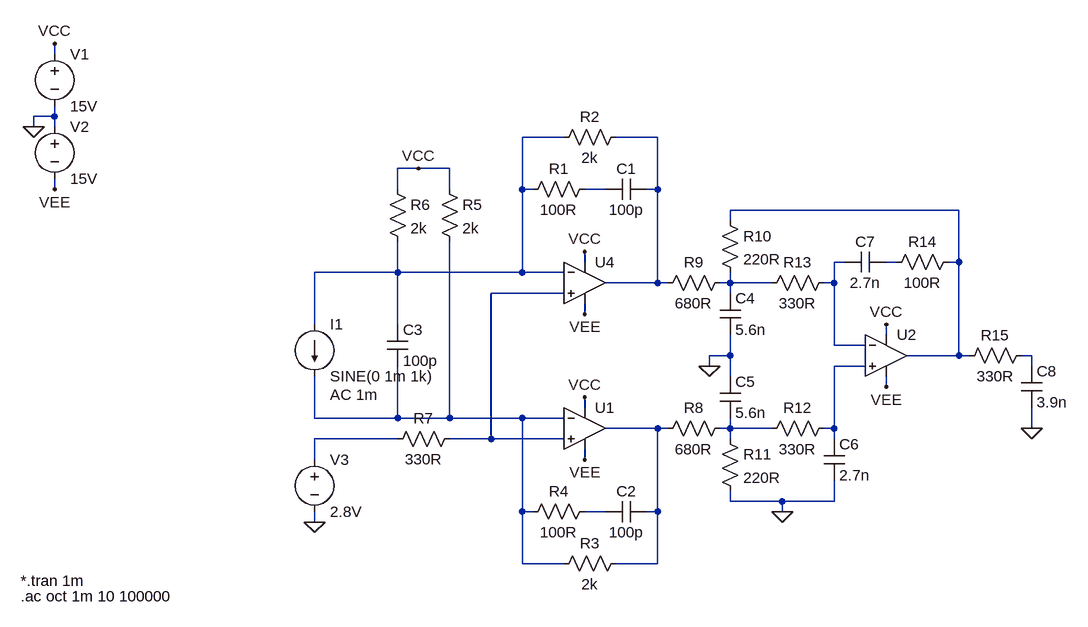
[diagram p0: schematic Outbuffer.asc]
Outbuffer.asc, the LTspice schematic file:
Version 4
SHEET 1 880 692
WIRE -736 -224 -736 -240
WIRE -736 -128 -736 -144
WIRE -736 -128 -768 -128
WIRE -768 -112 -768 -128
WIRE -736 -112 -736 -128
WIRE 48 -96 -16 -96
WIRE 192 -96 128 -96
WIRE -176 -48 -208 -48
WIRE -128 -48 -176 -48
WIRE -736 -16 -736 -32
WIRE -208 -16 -208 -48
WIRE -128 -16 -128 -48
WIRE -16 -16 -16 -96
WIRE 0 -16 -16 -16
WIRE 112 -16 80 -16
WIRE 192 -16 192 -96
WIRE 192 -16 176 -16
WIRE 656 16 304 16
WIRE 304 32 304 16
WIRE 80 96 80 80
WIRE 480 96 464 96
WIRE 560 96 544 96
WIRE 656 96 656 16
WIRE 656 96 640 96
WIRE -208 112 -208 64
WIRE -208 112 -336 112
WIRE -16 112 -16 -16
WIRE -16 112 -208 112
WIRE 48 112 -16 112
WIRE 192 128 192 -16
WIRE 192 128 112 128
WIRE 208 128 192 128
WIRE 304 128 304 112
WIRE 304 128 288 128
WIRE 368 128 304 128
WIRE 464 128 464 96
WIRE 464 128 448 128
WIRE 48 144 -64 144
WIRE 304 144 304 128
WIRE 80 176 80 160
WIRE -336 192 -336 112
WIRE -208 192 -208 112
WIRE 544 208 544 192
WIRE 464 224 464 128
WIRE 512 224 464 224
WIRE 304 240 304 208
WIRE 304 240 272 240
WIRE 656 240 656 96
WIRE 656 240 576 240
WIRE 672 240 656 240
WIRE 768 240 752 240
WIRE 272 256 272 240
WIRE 512 256 464 256
WIRE 768 256 768 240
WIRE 304 272 304 240
WIRE 544 288 544 272
WIRE 80 320 80 304
WIRE -336 336 -336 272
WIRE -208 336 -208 256
WIRE -208 336 -336 336
WIRE -128 336 -128 64
WIRE -128 336 -208 336
WIRE -16 336 -128 336
WIRE 48 336 -16 336
WIRE 192 352 112 352
WIRE 208 352 192 352
WIRE 304 352 304 336
WIRE 304 352 288 352
WIRE 368 352 304 352
WIRE 464 352 464 256
WIRE 464 352 448 352
WIRE 768 352 768 320
WIRE -208 368 -336 368
WIRE -64 368 -64 144
WIRE -64 368 -128 368
WIRE 48 368 -64 368
WIRE 304 368 304 352
WIRE 464 368 464 352
WIRE -336 400 -336 368
WIRE 80 400 80 384
WIRE 304 464 304 448
WIRE 384 464 304 464
WIRE 464 464 464 432
WIRE 464 464 384 464
WIRE -16 480 -16 336
WIRE 0 480 -16 480
WIRE 112 480 80 480
WIRE 192 480 192 352
WIRE 192 480 176 480
WIRE 384 480 384 464
WIRE -336 496 -336 480
WIRE -16 560 -16 480
WIRE 48 560 -16 560
WIRE 192 560 192 480
WIRE 192 560 128 560
FLAG -736 -240 VCC
FLAG -736 -16 VEE
FLAG -768 -112 0
FLAG 80 80 VCC
FLAG 80 176 VEE
FLAG 80 304 VCC
FLAG 80 400 VEE
FLAG 544 192 VCC
FLAG 544 288 VEE
FLAG -176 -48 VCC
FLAG -336 496 0
FLAG 272 256 0
FLAG 384 480 0
FLAG 768 352 0
SYMBOL voltage -736 -240 R0
WINDOW 123 0 0 Left 0
WINDOW 39 0 0 Left 0
SYMATTR InstName V1
SYMATTR Value 15V
SYMBOL voltage -736 -128 R0
WINDOW 123 0 0 Left 0
WINDOW 39 0 0 Left 0
SYMATTR InstName V2
SYMATTR Value 15V
SYMBOL cap 176 -32 R90
WINDOW 0 0 32 VBottom 2
WINDOW 3 32 32 VTop 2
SYMATTR InstName C1
SYMATTR Value 100p
SYMBOL res 96 -32 R90
WINDOW 0 0 56 VBottom 2
WINDOW 3 32 56 VTop 2
SYMATTR InstName R1
SYMATTR Value 100R
SYMBOL res 144 -112 R90
WINDOW 0 0 56 VBottom 2
WINDOW 3 32 56 VTop 2
SYMATTR InstName R2
SYMATTR Value 2k
SYMBOL res 144 544 R90
WINDOW 0 0 56 VBottom 2
WINDOW 3 32 56 VTop 2
SYMATTR InstName R3
SYMATTR Value 2k
SYMBOL cap 176 464 R90
WINDOW 0 0 32 VBottom 2
WINDOW 3 32 32 VTop 2
SYMATTR InstName C2
SYMATTR Value 100p
SYMBOL res 96 464 R90
WINDOW 0 0 56 VBottom 2
WINDOW 3 32 56 VTop 2
SYMATTR InstName R4
SYMATTR Value 100R
SYMBOL res -144 -32 R0
SYMATTR InstName R5
SYMATTR Value 2k
SYMBOL res -224 -32 R0
SYMATTR InstName R6
SYMATTR Value 2k
SYMBOL cap -224 192 R0
SYMATTR InstName C3
SYMATTR Value 100p
SYMBOL res -112 352 R90
WINDOW 0 0 56 VBottom 2
WINDOW 3 32 56 VTop 2
SYMATTR InstName R7
SYMATTR Value 330R
SYMBOL current -336 192 R0
WINDOW 123 24 108 Left 2
WINDOW 39 0 0 Left 0
SYMATTR InstName I1
SYMATTR Value SINE(0 1m 1k)
SYMATTR Value2 AC 1m
SYMBOL voltage -336 384 R0
WINDOW 123 0 0 Left 0
WINDOW 39 0 0 Left 0
SYMATTR InstName V3
SYMATTR Value 2.8V
SYMBOL res 304 336 R90
WINDOW 0 0 56 VBottom 2
WINDOW 3 32 56 VTop 2
SYMATTR InstName R8
SYMATTR Value 680R
SYMBOL res 304 112 R90
WINDOW 0 0 56 VBottom 2
WINDOW 3 32 56 VTop 2
SYMATTR InstName R9
SYMATTR Value 680R
SYMBOL cap 288 144 R0
SYMATTR InstName C4
SYMATTR Value 5.6n
SYMBOL cap 288 272 R0
SYMATTR InstName C5
SYMATTR Value 5.6n
SYMBOL res 288 16 R0
SYMATTR InstName R10
SYMATTR Value 220R
SYMBOL res 288 352 R0
SYMATTR InstName R11
SYMATTR Value 220R
SYMBOL res 464 336 R90
WINDOW 0 0 56 VBottom 2
WINDOW 3 32 56 VTop 2
SYMATTR InstName R12
SYMATTR Value 330R
SYMBOL res 464 112 R90
WINDOW 0 0 56 VBottom 2
WINDOW 3 32 56 VTop 2
SYMATTR InstName R13
SYMATTR Value 330R
SYMBOL cap 448 368 R0
SYMATTR InstName C6
SYMATTR Value 2.7n
SYMBOL cap 544 80 R90
WINDOW 0 0 32 VBottom 2
WINDOW 3 32 32 VTop 2
SYMATTR InstName C7
SYMATTR Value 2.7n
SYMBOL res 656 80 R90
WINDOW 0 0 56 VBottom 2
WINDOW 3 32 56 VTop 2
SYMATTR InstName R14
SYMATTR Value 100R
SYMBOL res 768 224 R90
WINDOW 0 0 56 VBottom 2
WINDOW 3 32 56 VTop 2
SYMATTR InstName R15
SYMATTR Value 330R
SYMBOL cap 752 256 R0
SYMATTR InstName C8
SYMATTR Value 3.9n
SYMBOL Opamps\\UniversalOpamp2 80 128 R0
SYMATTR InstName U4
SYMBOL Opamps\\UniversalOpamp2 80 352 R0
SYMATTR InstName U1
SYMBOL Opamps\\UniversalOpamp2 544 240 R0
SYMATTR InstName U2
TEXT -788 610 Left 2 !.ac oct 1m 10 100000
TEXT -788 586 Left 2 !*.tran 1m

The netlist it stands for:
* Outbuffer.asc
V1 VCC 0 15V
V2 0 VEE 15V
C1 N002 N003 100p
R1 N003 N001 100R
R2 N002 N001 2k
R3 N012 N011 2k
C2 N012 N015 100p
R4 N015 N011 100R
R5 VCC N011 2k
R6 VCC N001 2k
C3 N001 N011 100p
R7 N008 N014 330R
I1 N001 N011 SINE(0 1m 1k) AC 1m
V3 N014 0 2.8V
R8 N013 N012 680R
R9 N007 N002 680R
C4 N007 0 5.6n
C5 0 N013 5.6n
R10 N004 N007 220R
R11 N013 0 220R
R12 N010 N013 330R
R13 N005 N007 330R
C6 N010 0 2.7n
C7 N006 N005 2.7n
R14 N004 N006 100R
R15 N009 N004 330R
C8 N009 0 3.9n
XU4 N008 N001 VCC VEE N002 level.2 Avol=1Meg GBW=10Meg Slew=10Meg ilimit=25m rail=0 Vos=0 phimargin=45 en=0 enk=0 in=0 ink=0 Rin=500Meg  ; pins IN+ IN- V+ V- OUT
XU1 N008 N011 VCC VEE N012 level.2 Avol=1Meg GBW=10Meg Slew=10Meg ilimit=25m rail=0 Vos=0 phimargin=45 en=0 enk=0 in=0 ink=0 Rin=500Meg  ; pins IN+ IN- V+ V- OUT
XU2 N010 N005 VCC VEE N004 level.2 Avol=1Meg GBW=10Meg Slew=10Meg ilimit=25m rail=0 Vos=0 phimargin=45 en=0 enk=0 in=0 ink=0 Rin=500Meg  ; pins IN+ IN- V+ V- OUT
.ac oct 1m 10 100000
*.tran 1m
.lib UniversalOpamps2.sub
.backanno
.end